# EAGLE design untitled (EAGLE 9.2.2)
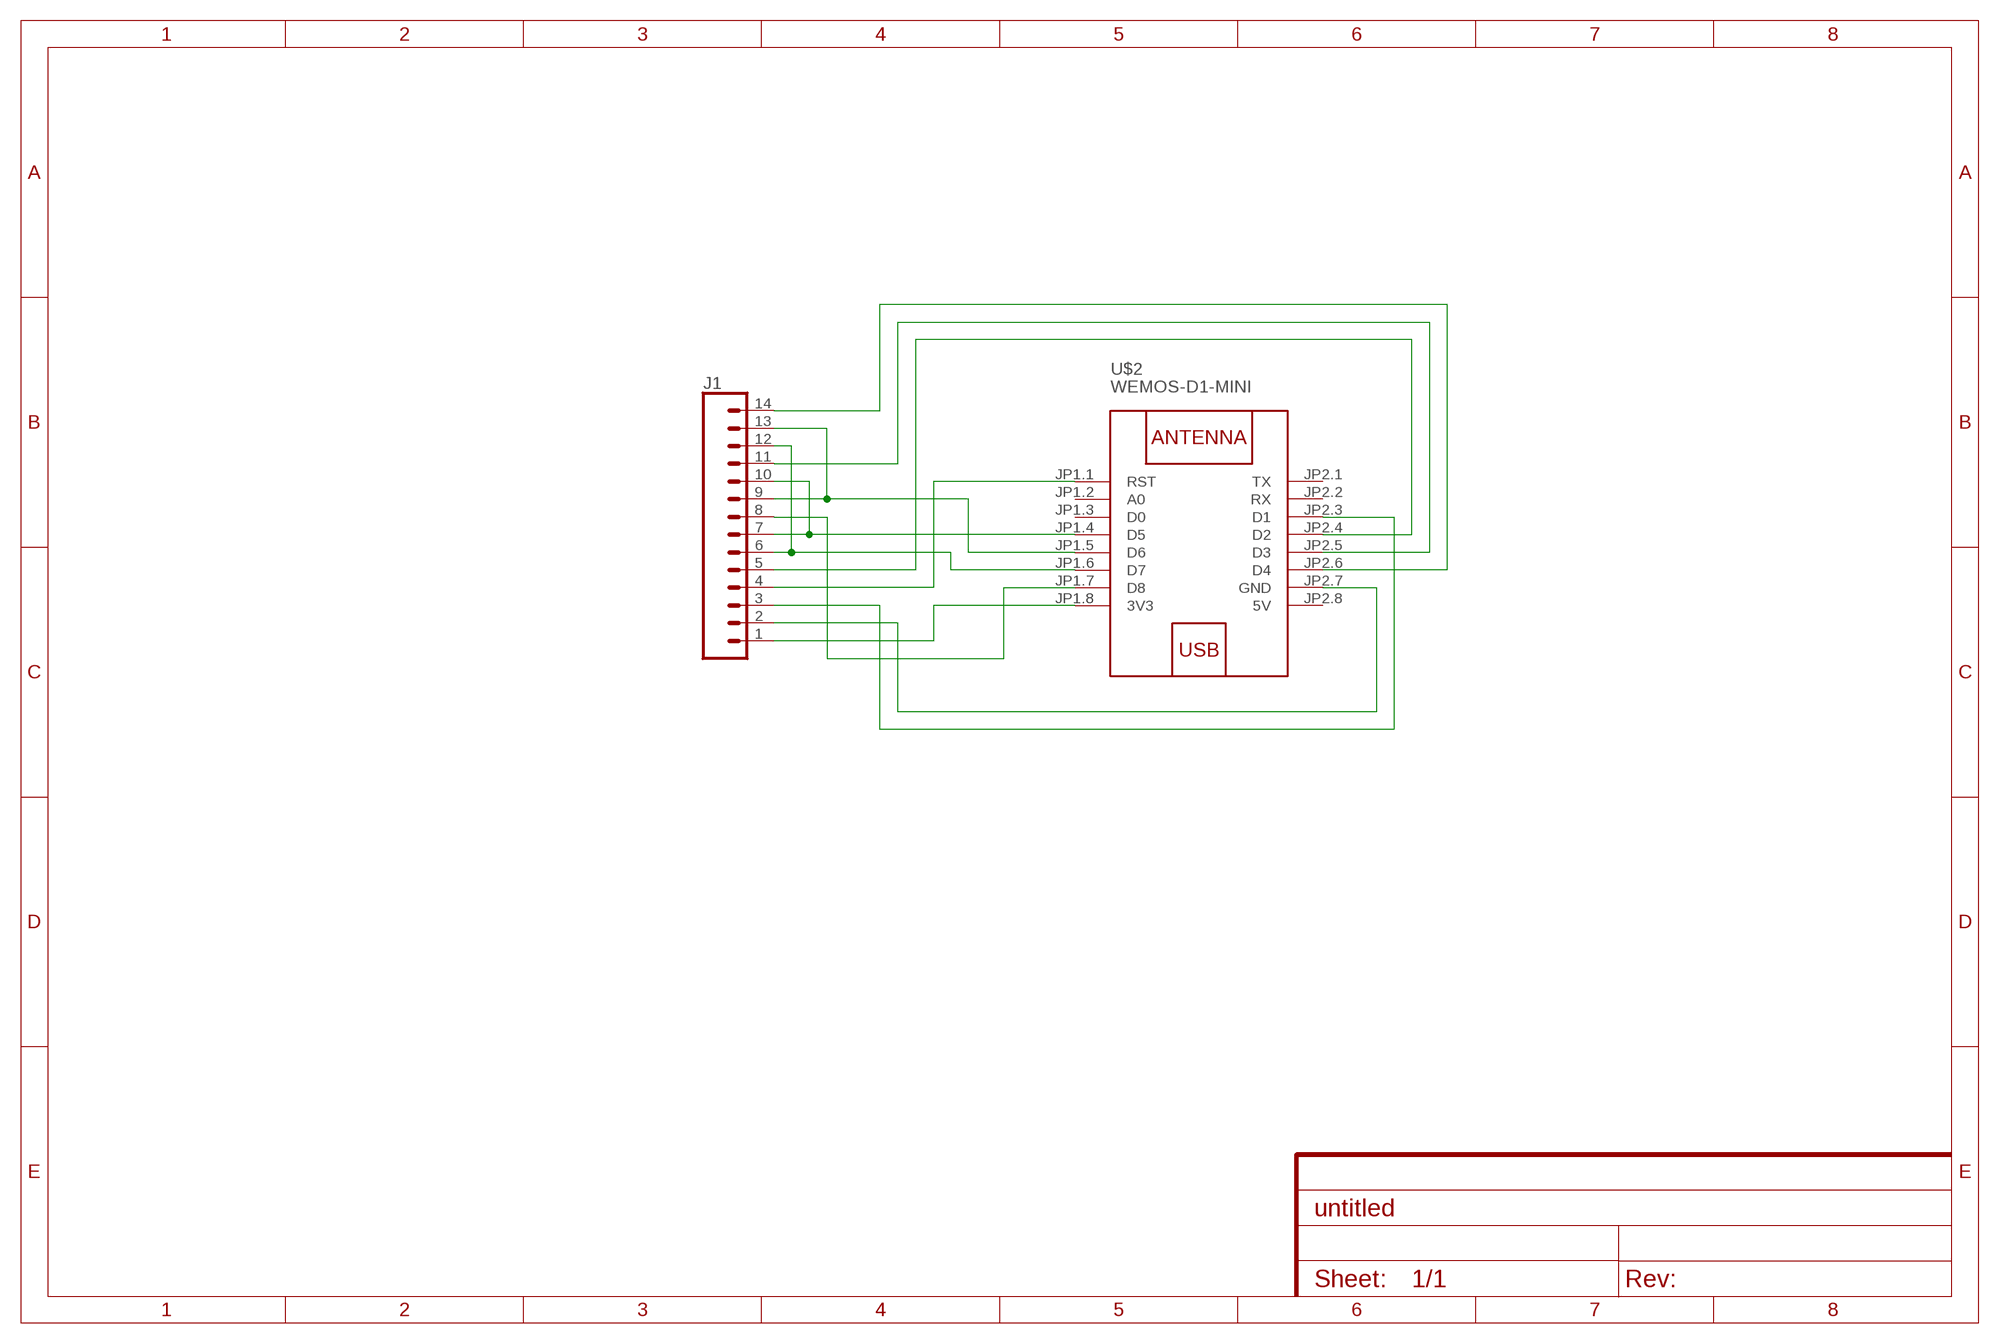
[diagram p0: schematic, sheet 1]

## Parts
J1  CONN_14  [1X14]
U$2  WEMOS-D1-MINI  [WEMOS-D1-MINI]

## Nets
N$1: J1.1 U$2.JP1.8(3V3)
N$2: J1.2 U$2.JP2.7(GND)
N$3: J1.3 U$2.JP2.3(D1)
N$4: J1.4 U$2.JP1.1(RST)
N$5: J1.5 U$2.JP2.4(D2)
N$6: J1.6 J1.12 U$2.JP1.6(D7)
N$7: J1.9 J1.13 U$2.JP1.5(D6)
N$8: J1.7 J1.10 U$2.JP1.4(D5)
N$9: J1.8 U$2.JP1.7(D8)
N$10: J1.11 U$2.JP2.5(D3)
N$11: J1.14 U$2.JP2.6(D4)
Unconnected: U$2.JP1.2(A0) U$2.JP1.3(D0) U$2.JP2.1(TX) U$2.JP2.2(RX)

## Power pins joined to a net without a drawn wire
5V: U$2.JP2.8(5V)

## Library data of the parts
J1 = SparkFun-Connectors:CONN_14: Multi connection point. Often used as Generic Header-pin footprint for 0.1 inch spaced/style header connections On any of the 0.1 inch spaced packages, you can populate with these: Break Away Headers - Straight <https://www.sparkfun.com/products/116> (PRT-00116) Break Away Male Headers - Right Angle <https://www.sparkfun.com/products/553> (PRT-00553) Female Headers <https://www.sparkfun.com/products/115> (PRT-00115) Break Away Headers - Machine Pin <https://www.sparkfun.com/products/117> (PRT-00117) Break Away Female Headers - Swiss Machine Pin <https://www.sparkfun.com/products/743> (PRT-00743) For SCREWTERMINALS and SPRING TERMINALS visit here: Screw Terimnals on SparkFun.com <https://www.sparkfun.com/search/results?term=Screw+Terminals> (5mm/3.5mm/2.54mm spacing) This device is also useful as a general connection point to wire up your design to another part of your project. Our various solder wires solder well into these plated through hole pads. Hook-Up Wire - Assortment (Stranded, 22 AWG) <https://www.sparkfun.com/products/11375> (PRT-11375) Hook-Up Wire - Assortment (Solid Core, 22 AWG) <https://www.sparkfun.com/products/11367> (PRT-11367) View the entire wire category on our website here <https://www.sparkfun.com/categories/141> Special notes: Molex polarized connector foot print use with SKU : PRT-08231 with associated crimp pins and housings. 1MM SMD Version SKU: PRT-10208 NOTES ON THE VARIANTS LOCK and LOCK_LONGPADS... This footprint was designed to help hold the alignment of a through-hole component (i.e. 6-pin header) while soldering it into place. You may notice that each hole has been shifted either up or down by 0.005 of an inch from it's more standard position (which is a perfectly straight line). This slight alteration caused the pins (the squares in the middle) to touch the edges of the holes. Because they are alternating, it causes a "brace" to hold the component in place. 0.005 has proven to be the perfect amount of "off-center" position when using our standard breakaway headers. Although looks a little odd when you look at the bare footprint, once you have a header in there, the alteration is very hard to notice. Also,if you push a header all the way into place, it is covered up entirely on the bottom side.
U$2 = diy-modules:WEMOS-D1-MINI: WEMOS D1 mini: Mini Wi-Fi Board based on ESP-8266 device More details can be found here: https://www.wemos.cc/product/d1-mini.html Click here to find device on ebay.com <http://www.ebay.com/sch/wemos+d1+mini+nodemcu>

## Board
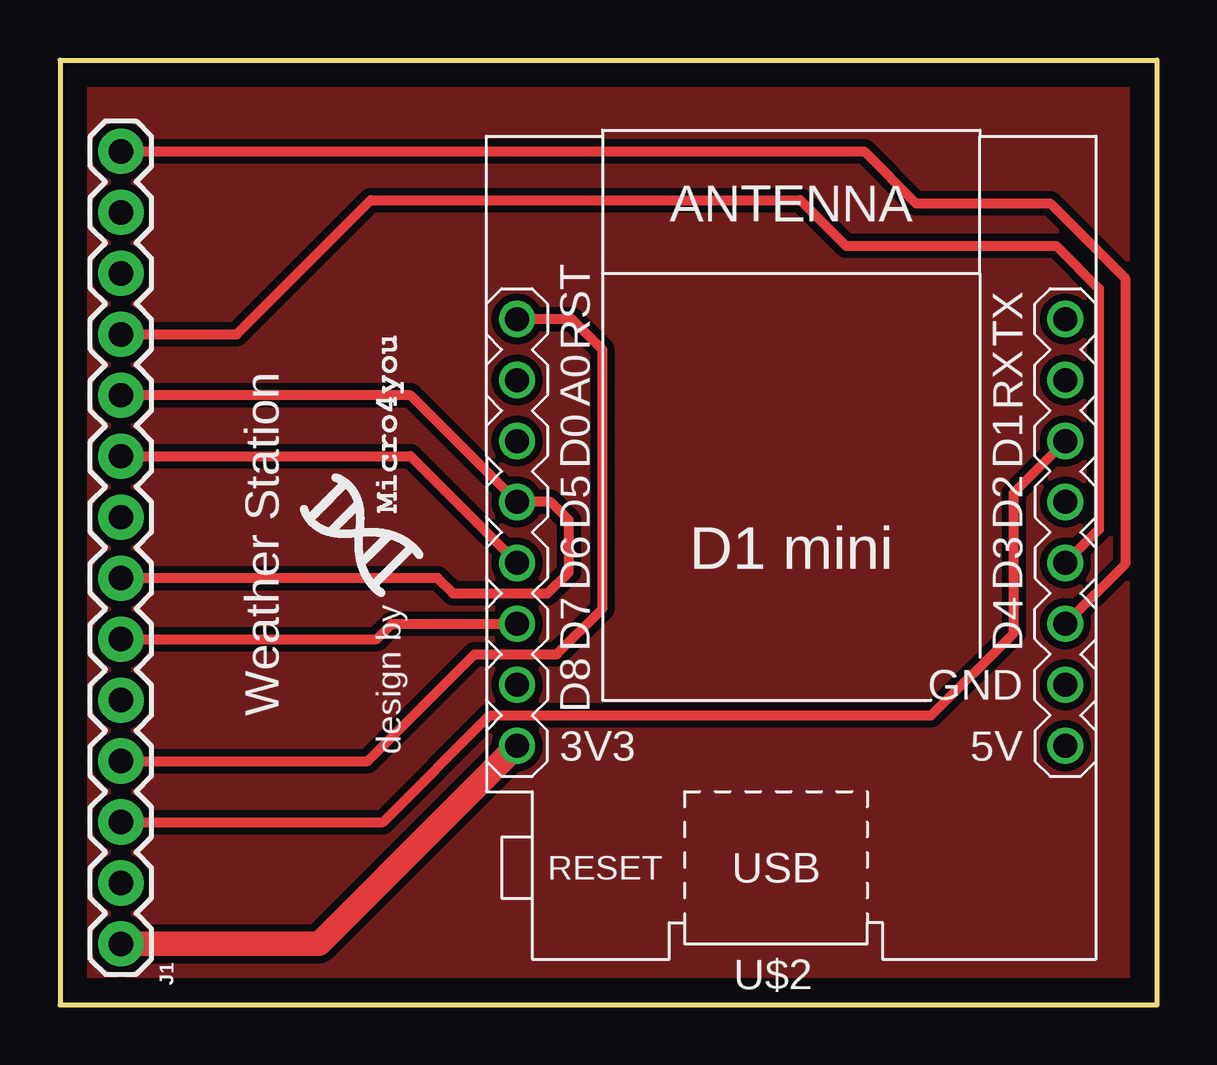
[diagram p1: board, top side]
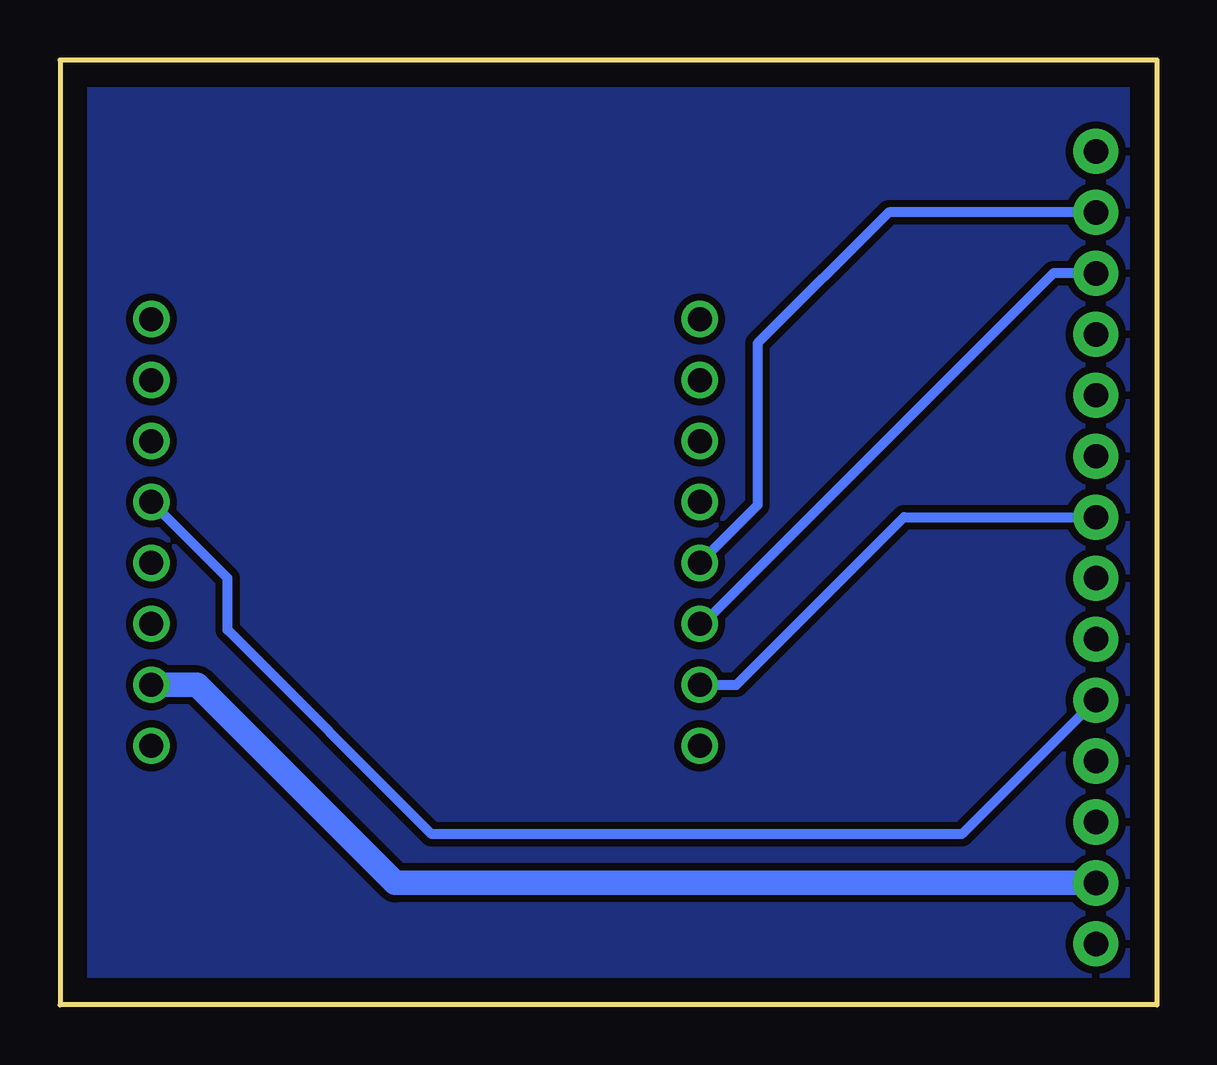
[diagram p2: board, bottom side, seen from below]

Size 45.72 x 39.37 mm. Coordinates in mm from the lower left corner, seen from the top.
Outline: 0,39.37 45.72,39.37 45.72,0 0,0 0,39.37
Copper layers (1*16): Top 0.035mm / dielectric 1.5mm / Bottom 0.035mm
Design rules "default": minimum track width 6mil, minimum drill 0.35mm, track to track 6mil, track to pad 6mil, pad to pad 6mil, via to via 6mil, smd to smd 6mil, copper to edge 40mil, drill to drill 6mil, minimum pad ring 10mil, minimum via ring 8mil, stop-mask expansion 4mil, vias tented up to drill 0mil, thermal gap 10mil

### Footprints (pad centres in the part's own frame; a part is rotated, then mirrored left to right if it is on the bottom)
1X14 = drill 1.016 pad 1.88: 1 0,0; 2 2.54,0; 3 5.08,0; 4 7.62,0; 5 10.16,0; 6 12.7,0; 7 15.24,0; 8 17.78,0; 9 20.32,0; 10 22.86,0; 11 25.4,0; 12 27.94,0; 13 30.48,0; 14 33.02,0
WEMOS-D1-MINI = drill 1: JP1.1 -11.43,9.525; JP1.2 -11.43,6.985; JP1.3 -11.43,4.445; JP1.4 -11.43,1.905; JP1.5 -11.43,-0.635; JP1.6 -11.43,-3.175; JP1.7 -11.43,-5.715; JP1.8 -11.43,-8.255; JP2.1 11.43,9.525; JP2.2 11.43,6.985; JP2.3 11.43,4.445; JP2.4 11.43,1.905; JP2.5 11.43,-0.635; JP2.6 11.43,-3.175; JP2.7 11.43,-5.715; JP2.8 11.43,-8.255

### Placement (x,y rotation side)
J1  2.54,2.54 90 top
U$2  30.48,19.05 0 top

### Tracks (layer width: path | path; a pad name or v marks a point on that pad's centre or on a via)
GND
  pour Top (isolate 0.305): -0.76,40.13 -0.76,-0.51 46.23,-0.51 46.23,40.13
  pour Bottom (isolate 0.305): -0.76,40.13 -0.76,-0.51 46.23,-0.51 46.23,40.13
N$1
  Top 1.016: U$2.JP1.8 10.79,2.54 J1.1
N$2
  Bottom 1.016: J1.2 31.75,5.08 40,13.34 U$2.JP2.7
N$3
  Top 0.406: J1.3 13.46,7.62 17.91,12.07 36.32,12.07 39.75,15.49 39.75,21.34 U$2.JP2.3
N$4
  Top 0.406: J1.4 12.83,10.16 17.27,14.61 20.7,14.61 22.61,16.51 22.61,27.3 21.34,28.57 U$2.JP1.1
N$5
  Bottom 0.406: J1.5 8.13,7.11 30.23,7.11 38.73,15.62 38.73,17.78 U$2.JP2.4
N$6
  Top 0.406: J1.6 13.21,15.24 13.84,15.88 U$2.JP1.6
  Bottom 0.406: J1.12 4.32,30.48 18.92,15.88 U$2.JP1.6
N$7
  Top 0.406: J1.9 14.6,22.86 U$2.JP1.5
  Bottom 0.406: J1.13 11.18,33.02 16.64,27.56 16.64,20.83 U$2.JP1.5
N$8
  Top 0.406: J1.7 15.75,17.78 16.38,17.14 20.32,17.14 21.21,18.03 21.21,20.19 20.45,20.95 U$2.JP1.4 14.6,25.4 J1.10
N$9
  Bottom 0.406: U$2.JP1.7 17.53,13.34 10.54,20.32 J1.8
N$10
  Top 0.406: J1.11 7.37,27.94 12.95,33.53 30.86,33.53 32.77,31.62 41.53,31.62 43.31,29.84 43.31,19.81 U$2.JP2.5
N$11
  Top 0.406: J1.14 33.53,35.56 35.69,33.4 41.27,33.4 44.4,30.28 44.4,18.36 U$2.JP2.6

### Text on the board
tPlace: Weather Station | design by